# Altium project vov_radio_demo.PrjPcb
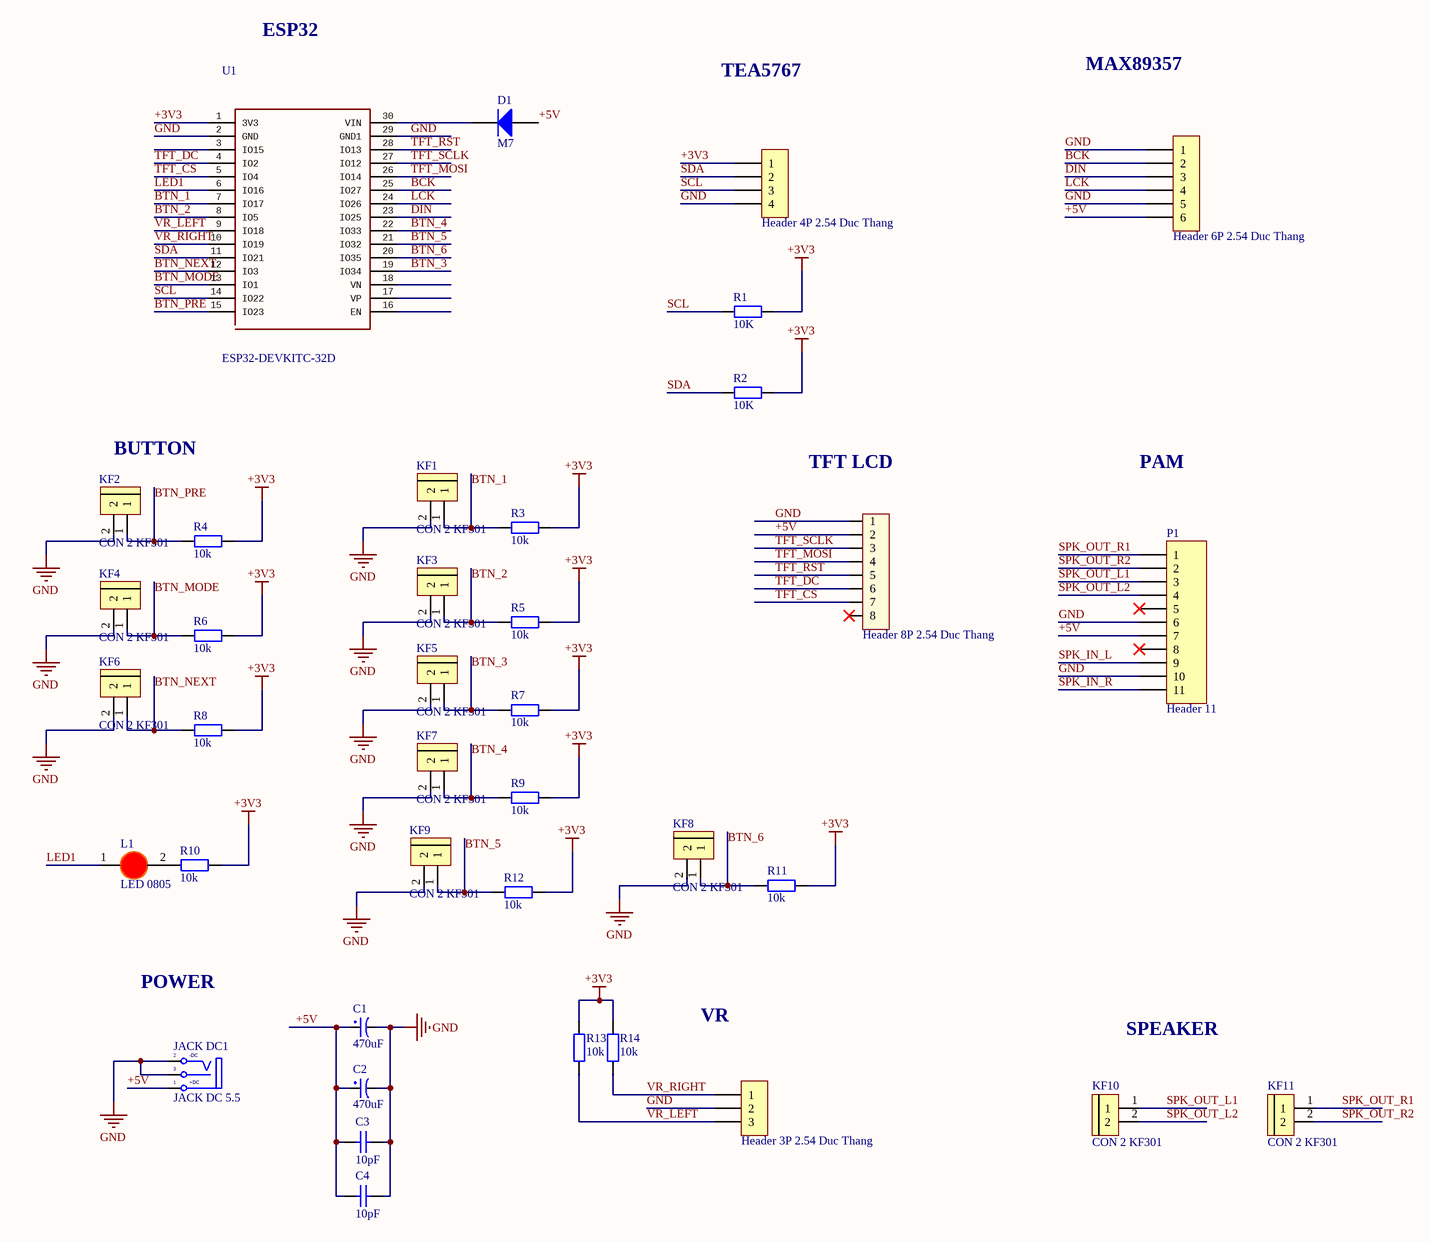
[diagram p0: esp32_radio_sch.SchDoc]
1 sheet, 38 parts. Net scope: global (net labels, ports and power ports of the same name join across sheets).
Board file: esp32_radio_pcb.PcbDoc

## Sheet esp32_radio_sch.SchDoc
size A3

### Parts
C1  470uF  [tu tantalum smd7343]
C2  470uF  [tu tantalum smd7343]
C3  10pF  [tu 0805]
C4  10pF  [tu 0805]
D1  M7  [DIODE SMA]
H1  Header 6P 2.54 Duc Thang  [XH2.54M-6]
H2  Header 4P 2.54 Duc Thang  [XH2.54M-4]
H3  Header 8P 2.54 Duc Thang  [XH2.54M-8]
H4  Header 3P 2.54 Duc Thang  [XH2.54M-3]
JACK_DC1  JACK DC 5.5  [JACK DC 5.5]
KF1  CON 2 KF301  [Nut Nhan 2 Chan SMD 3x6x2.5]
KF2  CON 2 KF301  [Nut Nhan 2 Chan SMD 3x6x2.5]
KF3  CON 2 KF301  [Nut Nhan 2 Chan SMD 3x6x2.5]
KF4  CON 2 KF301  [Nut Nhan 2 Chan SMD 3x6x2.5]
KF5  CON 2 KF301  [Nut Nhan 2 Chan SMD 3x6x2.5]
KF6  CON 2 KF301  [Nut Nhan 2 Chan SMD 3x6x2.5]
KF7  CON 2 KF301  [Nut Nhan 2 Chan SMD 3x6x2.5]
KF8  CON 2 KF301  [Nut Nhan 2 Chan SMD 3x6x2.5]
KF9  CON 2 KF301  [Nut Nhan 2 Chan SMD 3x6x2.5]
KF10  CON 2 KF301  [Con 2 KF301 5.08]
KF11  CON 2 KF301  [Con 2 KF301 5.08]
L1  LED 0805  [LED-0805-Red]
P1  Header 11  [Header 11]
R1  10K  [tro smd 0805]
R2  10K  [tro smd 0805]
R3  10k  [tro smd 0805]
R4  10k  [tro smd 0805]
R5  10k  [tro smd 0805]
R6  10k  [tro smd 0805]
R7  10k  [tro smd 0805]
R8  10k  [tro smd 0805]
R9  10k  [tro smd 0805]
R10  10k  [tro smd 0805]
R11  10k  [tro smd 0805]
R12  10k  [tro smd 0805]
R13  10k  [tro smd 0805]
R14  10k  [tro smd 0805]
U1  ESP32-DEVKITC-32D  [MODULE_ESP32-DEVKITV1]

### Nets
+3V3: H2.1 R1.2 R2.2 R3.2 R4.2 R5.2 R6.2 R7.2 R8.2 R9.2 R10.2 R11.2 R12.2 R13.2 R14.2 U1.1(3V3)
GND: C1.2 C2.2 C3.1 C4.1 H1.1 H1.5 H2.4 H3.1 H4.2 JACK_DC1.2(TN) JACK_DC1.3(S) KF1.2 KF2.2 KF3.2 KF4.2 KF5.2 KF6.2 KF7.2 KF8.2 KF9.2 P1.6 P1.10 U1.2(GND) U1.29(GND1)
+5V: C1.1 C2.1 C3.2 C4.2 D1.1(A) H1.6 H3.2 JACK_DC1.1(T) P1.7
BCK: H1.2 U1.25(IO27)
BTN_1: KF1.1 R3.1 U1.7(IO17)
BTN_2: KF3.1 R5.1 U1.8(IO5)
BTN_3: KF5.1 R7.1 U1.19(IO34)
BTN_4: KF7.1 R9.1 U1.22(IO33)
BTN_5: KF9.1 R12.1 U1.21(IO32)
BTN_6: KF8.1 R11.1 U1.20(IO35)
BTN_MODE: KF4.1 R6.1 U1.13(IO1)
BTN_NEXT: KF6.1 R8.1 U1.12(IO3)
BTN_PRE: KF2.1 R4.1 U1.15(IO23)
DIN: H1.3 U1.23(IO25)
LCK: H1.4 U1.24(IO26)
LED1: L1.1(A) U1.6(IO16)
SCL: H2.3 R1.1 U1.14(IO22)
SDA: H2.2 R2.1 U1.11(IO21)
SPK_IN_L: P1.9
SPK_IN_R: P1.11
SPK_OUT_L1: KF10.1 P1.3
SPK_OUT_L2: KF10.2 P1.4
SPK_OUT_R1: KF11.1 P1.1
SPK_OUT_R2: KF11.2 P1.2
TFT_CS: H3.7 U1.5(IO4)
TFT_DC: H3.6 U1.4(IO2)
TFT_MOSI: H3.4 U1.26(IO14)
TFT_RST: H3.5 U1.28(IO13)
TFT_SCLK: H3.3 U1.27(IO12)
VR_LEFT: H4.3 R13.1 U1.9(IO18)
VR_RIGHT: H4.1 R14.1 U1.10(IO19)
NetD1_2: D1.2(K) U1.30(VIN)
NetL1_2: L1.2(K) R10.1

Not connected (* = marked no-connect by the designer): H3 8*; P1 5* 8*; U1 3(IO15) 16(EN) 17(VP) 18(VN)

### Notes on the sheet
- ESP32
- TEA5767
- MAX89357
- BUTTON
- (near H3) TFT LCD
- PAM
- POWER
- VR
- SPEAKER
- (in symbol JACK DC 5.5) -DC; +DC

### Library data of the parts
C1 C2 = Tu tantalum 470uF 10V SMD7343: Dán; Don_Vi: Con; So_Chan: 2; Ten_Linh_Kien: Tụ tantalum 477A-470uF 10V SMD7343; Ma_Hang: MH001956; Chung_Loai: Dán; Kieu_Chan: *
C3 C4 = Tu 0805 10pF 50V 10%: Dán; Don_Vi: Con; So_Chan: 2; Ten_Linh_Kien: Tụ 0805 10P 10% 50V; Ma_Hang: MH004554; Chung_Loai: Dán; Kieu_Chan: *
D1 = Diode M7 ( 4007 ): Dán; Don_Vi: Con; Ten_Linh_Kien: Diode M7 1N4007 SMD 1A 1000V; Ma_Hang: MH000944; Chung_Loai: Dán; Ghi_Chu: *
H1 = Header 6P 2.54 Duc Thang: Cắm; Ten_Linh_Kien: Header 6P XH2.54-6P Đực Thẳng; Don_Vi: Con; Ma_Hang: MH001972; Chung_Loai: Cắm
H2 = Header 4P 2.54 Duc Thang: Cắm; Ten_Linh_Kien: Header 4P XH2.54-4P Đực Thẳng; Don_Vi: Con; Ma_Hang: MH001285; Chung_Loai: Cắm
H3 = Header 8P 2.54 Duc Thang: Cắm; Ten_Linh_Kien: Header 8P XH2.54-8P Đực Thẳng; Don_Vi: Con; Ma_Hang: MH003366; Chung_Loai: Cắm
H4 = Header 3P 2.54 Duc Thang: Cắm; Ten_Linh_Kien: Header 3P XH2.54-3P Đực Thẳng; Don_Vi: Con; Ma_Hang: MH001292; Chung_Loai: Cắm
JACK_DC1 = JACK DC 5.5: Value: Jac DC
KF1-KF11 = CON 2 KF301: Cắm; Ma_Hang: MH000987; Ten_Linh_Kien: CON 2 KF301-2P 5.08MM Xanh Dương; Chung_Loai: Cắm; Ghi_Chu: *; Kieu_Chan: *; Don_Vi: Con
L1 = LED 0805 Do: Dán; Don_Vi: Con; Ma_Hang: MH000897; Ten_Linh_Kien: LED 0805 Màu Đỏ (Red); Ghi_Chu: *; Kieu_Chan: *; Chung_Loai: Dán
P1 = Header 11: Header, 11-Pin; LatestRevisionDate: 17-Jul-2002; LatestRevisionNote: Re-released for DXP Platform.; Publisher: Altium Limited
R1-R14 = Tro 0805 1% 1k: Dán; Don_Vi: Con; So_Chan: 2; Ten_Linh_Kien: Trở 0805 1% 1k; Ma_Hang: MH005468; Chung_Loai: Dán; Kieu_Chan: *
U1 = ESP32-DEVKITC-32D: Eval Board For Esp-Wroom-32; MF: Espressif Systems; Availability: Unavailable; Package: None; SnapEDA_Link: https://www.snapeda.com/parts/ESP32-DEVKITC-32D/Espressif%20Systems/view-part/?ref=snap; MP: ESP32-DEVKITC-32D; Price: None; Value: *